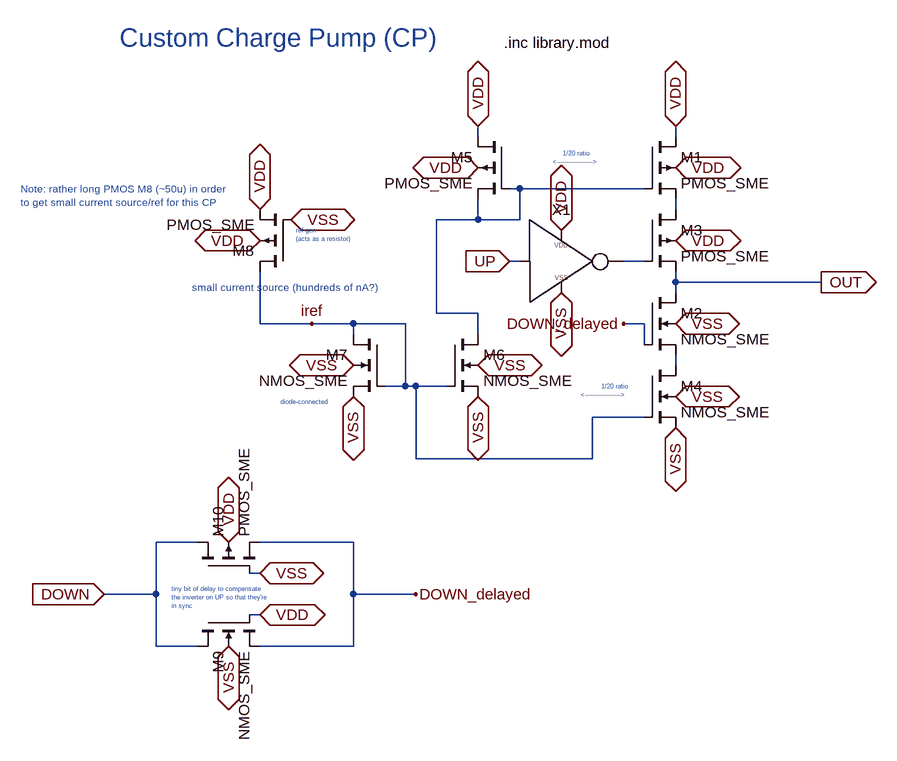
[diagram p0: schematic my_cp.asc]
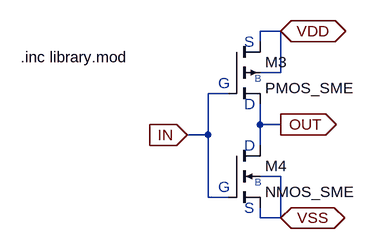
[diagram p1: sub-circuit my_inverter.asc]
my_cp.asc, the LTspice schematic file:
Version 4.1
SHEET 1 1236 1236
WIRE 400 192 400 176
WIRE 704 192 704 176
WIRE 464 272 448 272
WIRE 656 272 464 272
WIRE 704 304 704 288
WIRE 400 320 400 288
WIRE 400 320 336 320
WIRE 464 320 464 272
WIRE 464 320 400 320
WIRE 464 384 448 384
WIRE 656 384 624 384
WIRE 704 416 704 400
WIRE 928 416 704 416
WIRE 704 432 704 416
WIRE 336 464 336 320
WIRE 400 464 336 464
WIRE 64 480 64 400
WIRE 144 480 64 480
WIRE 208 480 144 480
WIRE 288 480 208 480
WIRE 656 480 624 480
WIRE 208 496 208 480
WIRE 400 496 400 464
WIRE 656 512 656 480
WIRE 704 544 704 528
WIRE 288 576 288 480
WIRE 288 576 256 576
WIRE 304 576 288 576
WIRE 352 576 304 576
WIRE 656 624 576 624
WIRE 304 688 304 576
WIRE 576 688 576 624
WIRE 576 688 304 688
WIRE -32 816 -96 816
WIRE 208 816 64 816
WIRE 64 864 48 864
WIRE -96 896 -96 816
WIRE -96 896 -176 896
WIRE 208 896 208 816
WIRE 304 896 208 896
WIRE 64 928 48 928
WIRE -96 976 -96 896
WIRE -32 976 -96 976
WIRE 208 976 208 896
WIRE 208 976 64 976
FLAG 448 384 UP
IOPIN 448 384 In
FLAG 400 176 VDD
IOPIN 400 176 BiDir
FLAG 928 416 OUT
IOPIN 928 416 Out
FLAG 704 640 VSS
IOPIN 704 640 BiDir
FLAG 704 592 VSS
IOPIN 704 592 BiDir
FLAG 704 480 VSS
IOPIN 704 480 BiDir
FLAG 704 176 VDD
IOPIN 704 176 BiDir
FLAG 704 240 VDD
IOPIN 704 240 BiDir
FLAG 704 352 VDD
IOPIN 704 352 BiDir
FLAG 400 240 VDD
IOPIN 400 240 BiDir
FLAG 400 592 VSS
IOPIN 400 592 BiDir
FLAG 400 544 VSS
IOPIN 400 544 BiDir
FLAG 208 592 VSS
IOPIN 208 592 BiDir
FLAG 208 544 VSS
IOPIN 208 544 BiDir
FLAG 528 336 VDD
IOPIN 528 336 BiDir
FLAG 528 432 VSS
IOPIN 528 432 BiDir
FLAG 112 320 VSS
IOPIN 112 320 BiDir
FLAG 64 304 VDD
IOPIN 64 304 BiDir
FLAG 64 352 VDD
IOPIN 64 352 BiDir
FLAG 144 480 iref
FLAG 624 480 DOWN_delayed
FLAG 304 896 DOWN_delayed
FLAG -176 896 DOWN
IOPIN -176 896 In
FLAG 16 976 VSS
IOPIN 16 976 BiDir
FLAG 64 928 VDD
IOPIN 64 928 BiDir
FLAG 16 816 VDD
IOPIN 16 816 BiDir
FLAG 64 864 VSS
IOPIN 64 864 BiDir
SYMBOL pmos4 656 192 R0
SYMATTR InstName M1
SYMATTR Value PMOS_SME
SYMATTR Value2 l=5u w=0.8u
SYMBOL nmos4 656 432 R0
SYMATTR InstName M2
SYMATTR Value NMOS_SME
SYMATTR Value2 l=0.35u w=0.4u
SYMBOL pmos4 656 304 R0
SYMATTR InstName M3
SYMATTR Value PMOS_SME
SYMATTR Value2 l=0.35u w=0.4u
SYMBOL nmos4 656 544 R0
SYMATTR InstName M4
SYMATTR Value NMOS_SME
SYMATTR Value2 l=5u w=0.4u
SYMBOL pmos4 448 192 M0
SYMATTR InstName M5
SYMATTR Value PMOS_SME
SYMATTR Value2 l=5u w=16u
SYMBOL nmos4 352 496 R0
SYMATTR InstName M6
SYMATTR Value NMOS_SME
SYMATTR Value2 l=5u w=8u
SYMBOL nmos4 256 496 M0
SYMATTR InstName M7
SYMATTR Value NMOS_SME
SYMATTR Value2 l=5u w=8u
SYMBOL my_inverter 528 384 R0
SYMATTR InstName X1
SYMBOL pmos4 112 400 R180
SYMATTR InstName M8
SYMATTR Value PMOS_SME
SYMATTR Value2 l=50u w=0.4u
SYMBOL nmos4 -32 928 M90
SYMATTR InstName M9
SYMATTR Value NMOS_SME
SYMATTR Value2 l=0.35u w=0.4u
SYMBOL pmos4 -32 864 R270
SYMATTR InstName M10
SYMATTR Value PMOS_SME
SYMATTR Value2 l=0.35u w=0.4u
TEXT -152 40 Left 4 ;Custom Charge Pump (CP)
TEXT 440 48 Left 2 !.inc library.mod
TEXT 96 600 Left 0 ;diode-connected
TEXT 552 224 Center 0 ;1/20 ratio\n<------------------>
TEXT 632 576 Right 0 ;1/20 ratio\n<------------------>
TEXT 120 336 Left 0 ;ref gen\n(acts as a resistor)
TEXT -40 424 Left 1 ;small current source (hundreds of nA?)
TEXT -304 272 Left 1 ;Note: rather long PMOS M8 (~50u) in order\nto get small current source/ref for this CP
TEXT -72 888 Left 0 ;tiny bit of delay to compensate\nthe inverter on UP so that they're\nin sync

my_inverter.asc, the sub-circuit schematic file:
Version 4.1
SHEET 1 880 680
WIRE 608 -32 576 -32
WIRE 576 -16 576 -32
WIRE 608 32 608 -32
WIRE 608 32 576 32
WIRE 528 64 496 64
WIRE 576 112 576 80
WIRE 608 112 576 112
WIRE 496 128 496 64
WIRE 496 128 464 128
WIRE 576 144 576 112
WIRE 608 192 576 192
WIRE 496 224 496 128
WIRE 528 224 496 224
WIRE 576 256 576 240
WIRE 608 256 608 192
WIRE 608 256 576 256
FLAG 608 -32 VDD
IOPIN 608 -32 BiDir
FLAG 608 256 VSS
IOPIN 608 256 BiDir
FLAG 608 112 OUT
IOPIN 608 112 Out
FLAG 464 128 IN
IOPIN 464 128 In
SYMBOL pmos4 528 -16 R0
SYMATTR InstName M3
SYMATTR Value PMOS_SME
SYMATTR Value2 l=0.35u w=0.4u
SYMBOL nmos4 528 144 R0
SYMATTR InstName M4
SYMATTR Value NMOS_SME
SYMATTR Value2 l=0.35u w=0.4u
TEXT 552 -16 Left 2 ;S
TEXT 552 240 Left 2 ;S
TEXT 552 80 Left 2 ;D
TEXT 552 144 Left 2 ;D
TEXT 512 48 Left 2 ;G
TEXT 512 208 Left 2 ;G
TEXT 568 40 Left 1 ;B
TEXT 568 200 Left 1 ;B
TEXT 208 8 Left 2 !.inc library.mod

The netlist it stands for:
* my_cp.asc
M1 VDD N001 N002 VDD PMOS_SME l=5u w=0.8u
M2 OUT DOWN_delayed N004 VSS NMOS_SME l=0.35u w=0.4u
M3 N002 N003 OUT VDD PMOS_SME l=0.35u w=0.4u
M4 N004 iref VSS VSS NMOS_SME l=5u w=0.4u
M5 VDD N001 N001 VDD PMOS_SME l=5u w=16u
M6 N001 iref VSS VSS NMOS_SME l=5u w=8u
M7 iref iref VSS VSS NMOS_SME l=5u w=8u
X§X1 UP N003 VDD VSS my_inverter
M8 iref VSS VDD VDD PMOS_SME l=50u w=0.4u
M9 DOWN VDD DOWN_delayed VSS NMOS_SME l=0.35u w=0.4u
M10 DOWN VSS DOWN_delayed VDD PMOS_SME l=0.35u w=0.4u

* block symbol definitions
.subckt my_inverter IN OUT VDD VSS
M3 VDD IN OUT VDD PMOS_SME l=0.35u w=0.4u
M4 OUT IN VSS VSS NMOS_SME l=0.35u w=0.4u
* S
* S
* D
* D
* G
* G
* B
* B
.inc library.mod
.ends my_inverter

.model NMOS NMOS
.model PMOS PMOS
.lib standard.mos
* Custom Charge Pump (CP)
.inc library.mod
* diode-connected
* 1/20 ratio
* <------------------>
* 1/20 ratio
* <------------------>
* ref gen
* (acts as a resistor)
* small current source (hundreds of nA?)
* Note: rather long PMOS M8 (~50u) in order
* to get small current source/ref for this CP
* tiny bit of delay to compensate
* the inverter on UP so that they're
* in sync
.backanno
.end